# Altium schematic sheet Filter Capacitors - FOTA ICSP.SchDoc: FOTA ICSP Filter Capacitors
size A4; DocumentNumber: 34; SheetNumber: 33; SheetTotal: 54
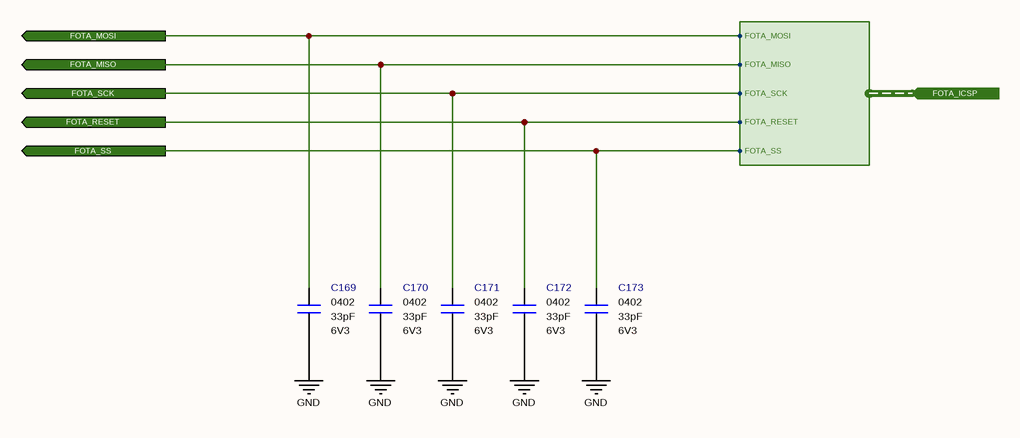
[diagram p0: Filter Capacitors - FOTA ICSP.SchDoc]

## Parts
C169  value 33pF  Case: 0402  Voltage: 6V3  [CAPACITOR_0402]  (hidden comment: Multilayer Ceramic Capacitor)
C170  value 33pF  Case: 0402  Voltage: 6V3  [CAPACITOR_0402]  (hidden comment: Multilayer Ceramic Capacitor)
C171  value 33pF  Case: 0402  Voltage: 6V3  [CAPACITOR_0402]  (hidden comment: Multilayer Ceramic Capacitor)
C172  value 33pF  Case: 0402  Voltage: 6V3  [CAPACITOR_0402]  (hidden comment: Multilayer Ceramic Capacitor)
C173  value 33pF  Case: 0402  Voltage: 6V3  [CAPACITOR_0402]  (hidden comment: Multilayer Ceramic Capacitor)

## Ports
FOTA_ICSP (in, harness FOTA_ICSP), FOTA_MISO (out), FOTA_MOSI (out), FOTA_RESET (out), FOTA_SCK (out), FOTA_SS (out)

## Harnesses
FOTA_ICSP: FOTA_RESET, FOTA_SCK, FOTA_MISO, FOTA_MOSI, FOTA_SS

## Nets
GND: C169.1 C170.1 C171.1 C172.1 C173.1
FOTA_MISO: C170.2 ; port FOTA_MISO, port FOTA_ICSP.FOTA_MISO
FOTA_MOSI: C169.2 ; port FOTA_MOSI, port FOTA_ICSP.FOTA_MOSI
FOTA_RESET: C172.2 ; port FOTA_RESET, port FOTA_ICSP.FOTA_RESET
FOTA_SCK: C171.2 ; port FOTA_SCK, port FOTA_ICSP.FOTA_SCK
FOTA_SS: C173.2 ; port FOTA_SS, port FOTA_ICSP.FOTA_SS

## Notes on the sheet
- Engineer
- All Rights are reserved to Customer and Engineer. [2021]
- Size:
- Date:
- A4
- Project :
- Time:
- Sheet
- of
- Customer
- Product ID
- Module ID
- Version
- File:
- Revision

## Library data of the parts
C169-C173 = Capacitor - 33pF [0402-6V3]: Capacitor - 33pF [0402] (Ceramic); Manufacturer Name: Kemet; Manufacturer Part Number: C0402C330J9RACAUTO; Dielectric: X7R; Tolerance: 10%; Height: 0.5mm; Maximum Operating Temperature: +125; Minimum Operating Temperature: -55; ROHS: Yes; ComponentLink1Description: DataSheet; ComponentLink1URL: https://api.kemet.com/component-edge/download/datasheet/C0402C330J9RACAUTO.pdf; ComponentLink2Description: Mouser; ComponentLink2URL: https://www.mouser.com/Search/Refine.aspx?Keyword=80-C0402C330J9RAUTO; Supplier 1: Mouser; Supplier Part Number 1: 80-C0402C330J9RAUTO; Mouser Part Number: 80-C0402C330J9RAUTO